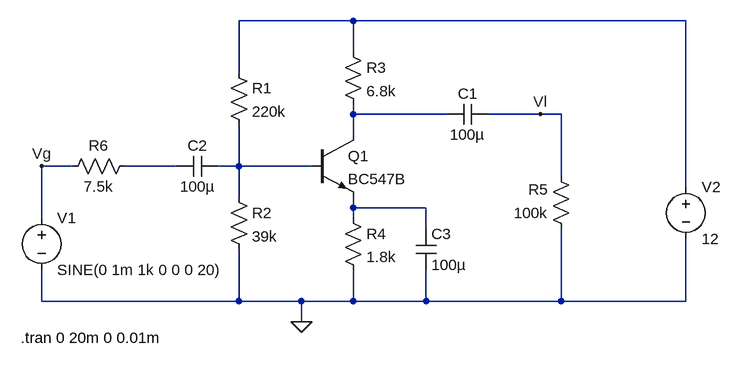
[diagram p0: schematic EmisorComun.asc]
EmisorComun.asc, the LTspice schematic file:
Version 4
SHEET 1 880 680
WIRE 32 -48 -144 -48
WIRE 544 -48 32 -48
WIRE 32 0 32 -48
WIRE -144 32 -144 -48
WIRE 32 96 32 80
WIRE 176 96 32 96
WIRE 320 96 240 96
WIRE 352 96 320 96
WIRE 32 128 32 96
WIRE -400 176 -448 176
WIRE -240 176 -320 176
WIRE -144 176 -144 112
WIRE -144 176 -176 176
WIRE -32 176 -144 176
WIRE 352 192 352 96
WIRE 544 208 544 -48
WIRE -144 224 -144 176
WIRE 32 240 32 224
WIRE 144 240 32 240
WIRE -448 256 -448 176
WIRE 32 256 32 240
WIRE 144 272 144 240
WIRE -448 384 -448 336
WIRE -144 384 -144 304
WIRE -144 384 -448 384
WIRE -48 384 -144 384
WIRE 32 384 32 336
WIRE 32 384 -48 384
WIRE 144 384 144 336
WIRE 144 384 32 384
WIRE 352 384 352 272
WIRE 352 384 144 384
WIRE 544 384 544 288
WIRE 544 384 352 384
WIRE -48 416 -48 384
FLAG -48 416 0
FLAG 320 96 Vl
FLAG -448 176 Vg
SYMBOL res -160 16 R0
SYMATTR InstName R1
SYMATTR Value 220k
SYMBOL res -160 208 R0
SYMATTR InstName R2
SYMATTR Value 39k
SYMBOL npn -32 128 R0
SYMATTR InstName Q1
SYMATTR Value BC547B
SYMBOL res 16 -16 R0
SYMATTR InstName R3
SYMATTR Value 6.8k
SYMBOL res 16 240 R0
SYMATTR InstName R4
SYMATTR Value 1.8k
SYMBOL voltage -448 240 R0
WINDOW 123 0 0 Left 2
WINDOW 39 0 0 Left 2
SYMATTR InstName V1
SYMATTR Value SINE(0 1m 1k 0 0 0 20)
SYMBOL voltage 544 192 R0
SYMATTR InstName V2
SYMATTR Value 12
SYMBOL res 368 288 R180
WINDOW 0 36 76 Left 2
WINDOW 3 36 40 Left 2
SYMATTR InstName R5
SYMATTR Value 100k
SYMBOL cap 240 80 R90
WINDOW 0 0 32 VBottom 2
WINDOW 3 32 32 VTop 2
SYMATTR InstName C1
SYMATTR Value 100µ
SYMBOL cap -176 160 R90
WINDOW 0 0 32 VBottom 2
WINDOW 3 32 32 VTop 2
SYMATTR InstName C2
SYMATTR Value 100µ
SYMBOL res -304 160 R90
WINDOW 0 0 56 VBottom 2
WINDOW 3 32 56 VTop 2
SYMATTR InstName R6
SYMATTR Value 7.5k
SYMBOL cap 128 272 R0
SYMATTR InstName C3
SYMATTR Value 100µ
TEXT -480 440 Left 2 !.tran 0 20m 0 0.01m

The netlist it stands for:
* EmisorComun.asc
R1 N001 N004 220k
R2 N004 0 39k
Q1 N002 N004 N005 0 BC547B
R3 N001 N002 6.8k
R4 N005 0 1.8k
V1 Vg 0 SINE(0 1m 1k 0 0 0 20)
V2 N001 0 12
R5 0 Vl 100k
C1 Vl N002 100µ
C2 N004 N003 100µ
R6 N003 Vg 7.5k
C3 N005 0 100µ
.model NPN NPN
.model PNP PNP
.lib standard.bjt
.tran 0 20m 0 0.01m
.backanno
.end